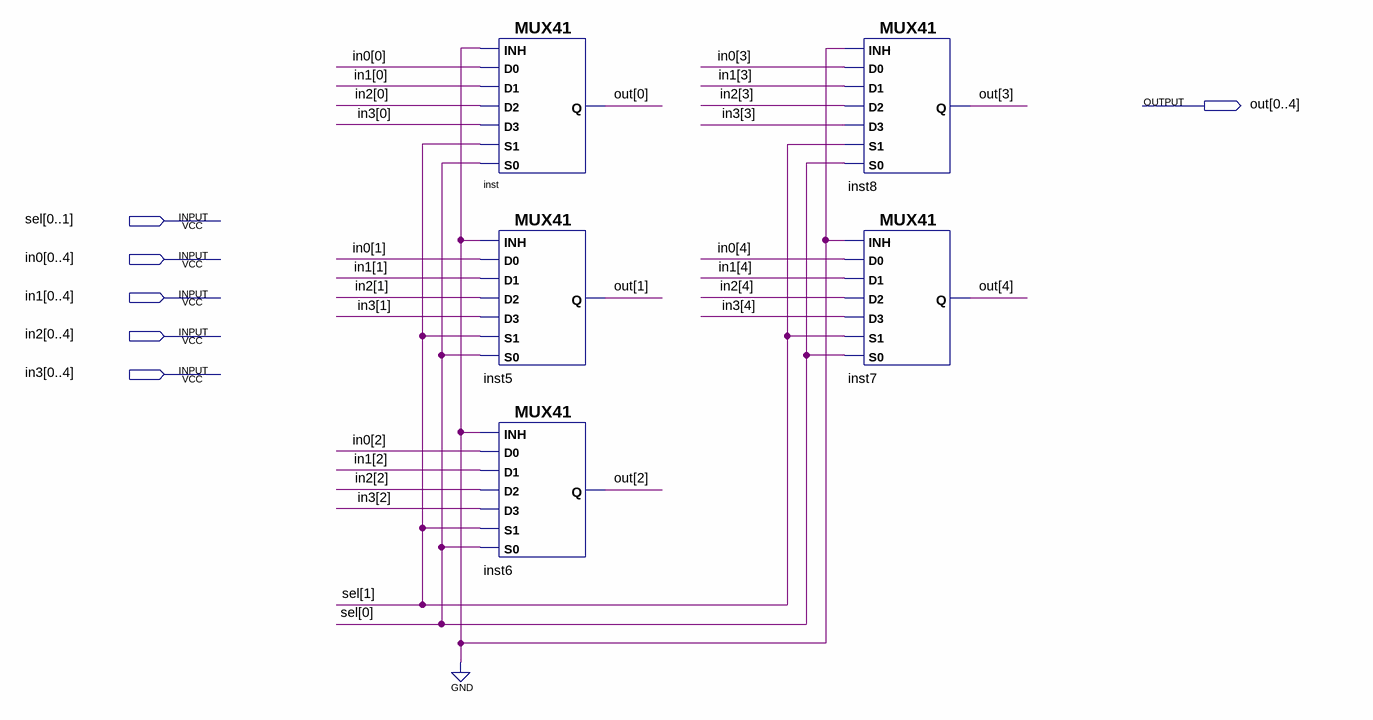
[diagram p0: schematic sheet]
// Quartus schematic 4x5Multiplexer.bdf as structural Verilog: 5 symbols, 6 pins
module \4x5Multiplexer  (
  input  [0:1] sel,
  input  [0:4] in0,
  input  [0:4] in1,
  input  [0:4] in2,
  input  [0:4] in3,
  output [0:4] out
);

  MUX41 inst (.S0(sel[0]), .D2(in2[0]), .S1(sel[1]), .D3(in3[0]), .D0(in0[0]), .INH(1'b0), .D1(in1[0]), .Q(out[0]));
  MUX41 inst5 (.S0(sel[0]), .D2(in2[1]), .S1(sel[1]), .D3(in3[1]), .D0(in0[1]), .INH(1'b0), .D1(in1[1]), .Q(out[1]));
  MUX41 inst6 (.S0(sel[0]), .D2(in2[2]), .S1(sel[1]), .D3(in3[2]), .D0(in0[2]), .INH(1'b0), .D1(in1[2]), .Q(out[2]));
  MUX41 inst8 (.S0(sel[0]), .D2(in2[3]), .S1(sel[1]), .D3(in3[3]), .D0(in0[3]), .INH(1'b0), .D1(in1[3]), .Q(out[3]));
  MUX41 inst7 (.S0(sel[0]), .D2(in2[4]), .S1(sel[1]), .D3(in3[4]), .D0(in0[4]), .INH(1'b0), .D1(in1[4]), .Q(out[4]));
endmodule
